# EasyEDA Pro project 达妙分电板_36mm间距_单板_V1.3.epro

# Schematic Schematic3_1
Board Name: V1.3; Create Date: 2025-01-14; Page Name: P1; Project Name: Humanoid Robot 分电板; Schematic Name: Schematic3_1; Update Date: 2025-01-14; Company: 嘉立创EDA; Page Size: A3; Version: V1.0
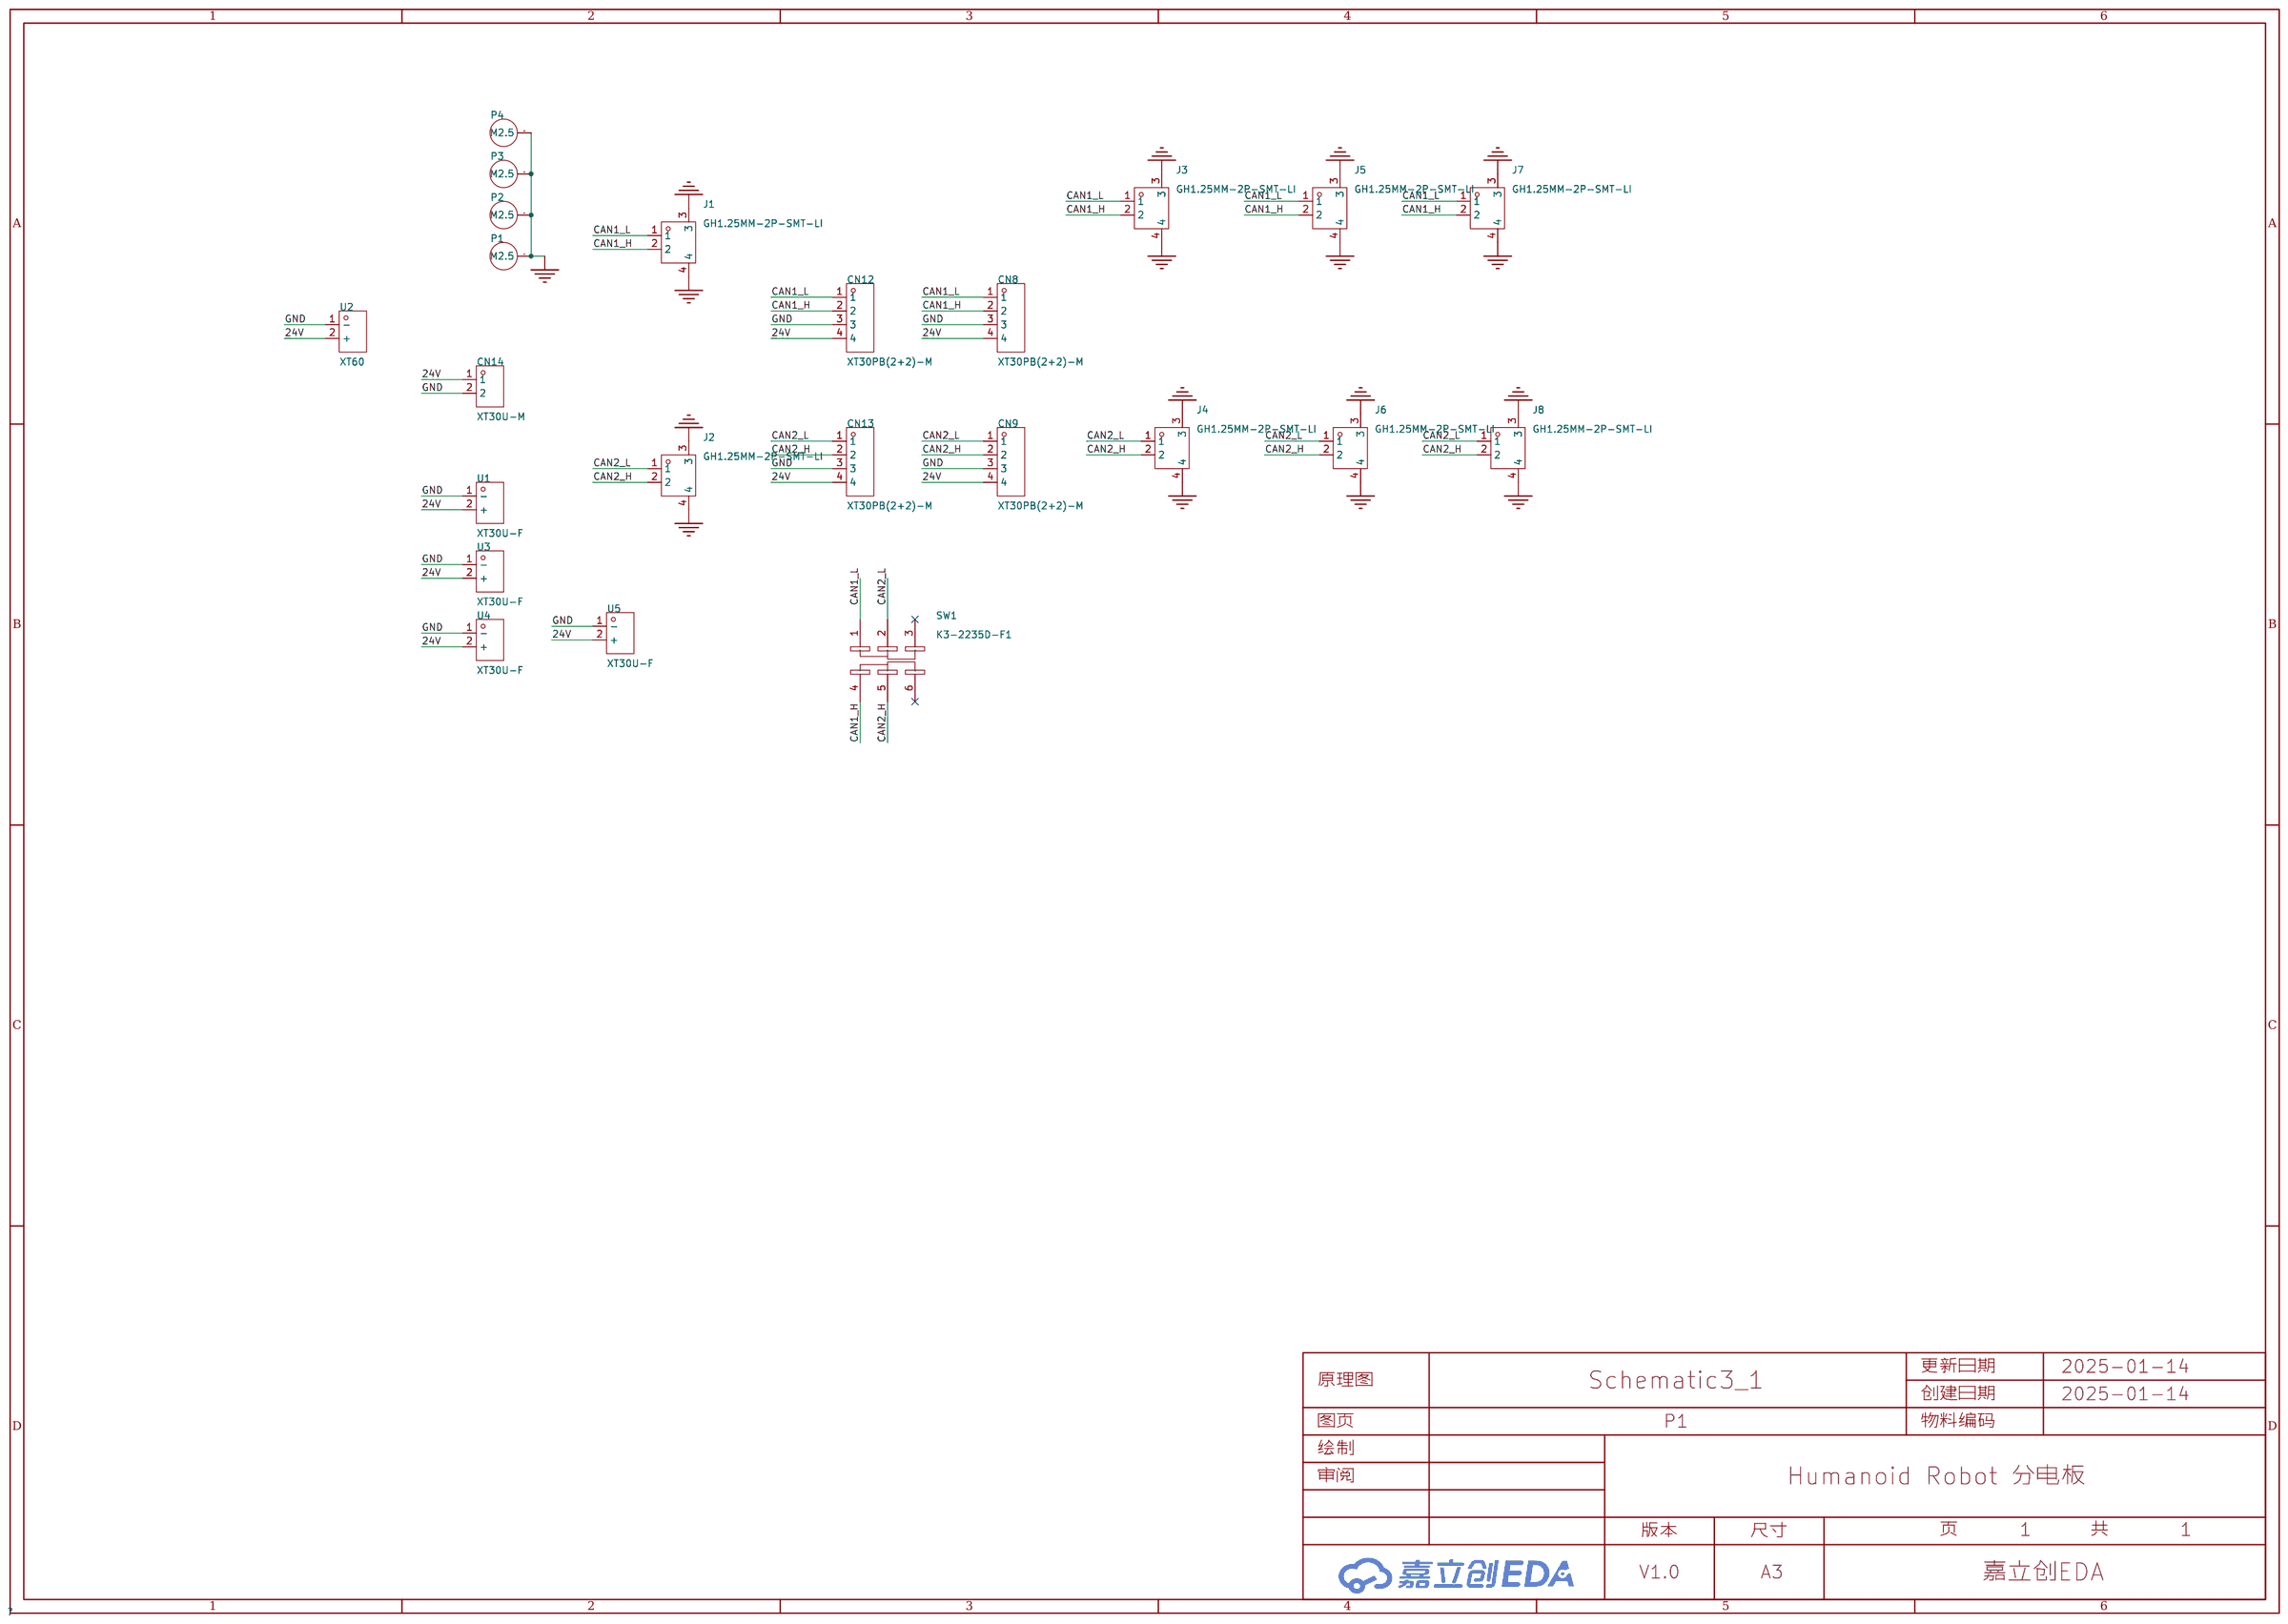
[diagram p0: schematic sheet]

## Parts
CN8  XT30PB(2+2)-M  [CONN-TH_XT30PB-M]
CN9  XT30PB(2+2)-M  [CONN-TH_XT30PB-M]
CN12  XT30PB(2+2)-M  [CONN-TH_XT30PB-M]
CN13  XT30PB(2+2)-M  [CONN-TH_XT30PB-M]
CN14  XT30U-M  [CONN-TH_XT30U-M]
J1  GH1.25MM-2P-SMT-LI  [CONN-SMD_2P-P1.25_GH1.25-2PLI]
J2  GH1.25MM-2P-SMT-LI  [CONN-SMD_2P-P1.25_GH1.25-2PLI]
J3  GH1.25MM-2P-SMT-LI  [CONN-SMD_2P-P1.25_GH1.25-2PLI]
J4  GH1.25MM-2P-SMT-LI  [CONN-SMD_2P-P1.25_GH1.25-2PLI]
J5  GH1.25MM-2P-SMT-LI  [CONN-SMD_2P-P1.25_GH1.25-2PLI]
J6  GH1.25MM-2P-SMT-LI  [CONN-SMD_2P-P1.25_GH1.25-2PLI]
J7  GH1.25MM-2P-SMT-LI  [CONN-SMD_2P-P1.25_GH1.25-2PLI]
J8  GH1.25MM-2P-SMT-LI  [CONN-SMD_2P-P1.25_GH1.25-2PLI]
P1  -  [M2.5_PAD]
P2  -  [M2.5_PAD]
P3  -  [M2.5_PAD]
P4  -  [M2.5_PAD]
SW1  K3-2235D-F1  [SW-TH_K3-2235D-F1]
U1  XT30U-F  [CONN-TH_XT30U-F]
U2  XT60  [CONN-TH_XT60]
U3  XT30U-F  [CONN-TH_XT30U-F]
U4  XT30U-F  [CONN-TH_XT30U-F]
U5  XT30U-F  [CONN-TH_XT30U-F]

## Library data of the parts
CN8 CN9 CN12 CN13 = XT30PB(2+2)-M: Supplier Part: C3040128; Manufacturer: AMASS(艾迈斯); Supplier Footprint: P=5mm; Datasheet: https://atta.szlcsc.com/upload/public/pdf/source/20220617/8874A8DD1903B9039419E118FC86C593.pdf; Supplier: LCSC
CN14 = XT30U-M: 类别:-;类型1:-;; LCSC Part Name: AMASS(艾迈斯)轻量版锂电池插头公头 XT30U-M; Supplier Part: C99101; Manufacturer: AMASS(艾迈斯); JLCPCB Part Class: 扩展库; Datasheet: https://atta.szlcsc.com/upload/public/pdf/source/20170606/1496716542582.pdf; Supplier: LCSC; Brand: 艾迈斯; Type: 插头; Colour: 黄色; InterfaceType: 公头
J1-J8 = GH1.25MM-2P-SMT-LI: Supplier Part: C9900017111; Supplier Footprint: GH1.25MM; JLCPCB Part Class: 扩展库; Supplier: LCSC
P1-P4 = M2.5焊盘固定孔
SW1 = K3-2235D-F1: 电路结构:双刀双掷;安装方式:直插;开关颜色:黑色;额定电流(DC):300mA;额定电压(DC):6V;额定电流(AC):-;额定电压(AC):-;机械寿命:1万次;; LCSC Part Name: 直插双档 滑动开关; Supplier Part: C189615; Manufacturer: 韩国韩荣; Supplier Footprint: 插件; JLCPCB Part Class: 扩展库; Datasheet: https://atta.szlcsc.com/upload/public/pdf/source/20210810/9F56F04DF7CBA8FC4D1B091DF1444945.pdf; Supplier: LCSC; Circuit: 双刀双掷; Actuator Style: 矩形柱状; Pin Style: PC引脚; Switch Length: 9mm; Switch Width: 3.5mm; Switch Height: 3.5mm; Mounting Style: 直插; Actuator Color: 黑色; Current Rating (DC): 300mA; Voltage Rating (DC): 6V; Mechanical Life: 1万次; Operating Temperature: -25℃~+80℃
U1 U3-U5 = XT30U-F: 类别:-;类型1:-;; LCSC Part Name: AMASS(艾迈斯)轻量版锂电池插头母头 XT30U-F; Supplier Part: C99102; Manufacturer: AMASS(艾迈斯); JLCPCB Part Class: 扩展库; Datasheet: https://atta.szlcsc.com/upload/public/pdf/source/20190916/C428721_B0ECB8C5937139CEFE8736D2D3175B0E.pdf; Supplier: LCSC; Brand: 艾迈斯; Type: 插头; Colour: 黄色; InterfaceType: 母头
U2 = XT60: 类别:-;类型1:-;; LCSC Part Name: AMASS(艾迈斯) XT60模型插头 3.5mm镀金香蕉头公头（电调端）XT60-M; Supplier Part: C98733; Manufacturer: AMASS(艾迈斯); JLCPCB Part Class: 扩展库; Datasheet: https://atta.szlcsc.com/upload/public/pdf/source/20170606/1496716524919.pdf; Supplier: LCSC; Brand: 艾迈斯; Type: 香蕉头; Colour: 黄色; InterfaceType: 公头; specifications: 3.5mm

## Nets
24V: CN8.4 CN9.4 CN12.4 CN13.4 CN14.1 U1.2(+) U2.2(+) U3.2(+) U4.2(+) U5.2(+)
GND: CN8.3 CN9.3 CN12.3 CN13.3 CN14.2 J1.3 J1.4 J2.3 J2.4 J3.3 J3.4 J4.3 J4.4 J5.3 J5.4 J6.3 J6.4 J7.3 J7.4 J8.3 J8.4 P1.1(M2.5) P2.1(M2.5) P3.1(M2.5) P4.1(M2.5) U1.1(-) U2.1(-) U3.1(-) U4.1(-) U5.1(-)
CAN1_H: CN8.2 CN12.2 J1.2 J3.2 J5.2 J7.2 SW1.4
CAN1_L: CN8.1 CN12.1 J1.1 J3.1 J5.1 J7.1 SW1.1
CAN2_H: CN9.2 CN13.2 J2.2 J4.2 J6.2 J8.2 SW1.5
CAN2_L: CN9.1 CN13.1 J2.1 J4.1 J6.1 J8.1 SW1.2

Not connected (* = marked no-connect by the designer): SW1 3* 6*

# Board PCB7_1
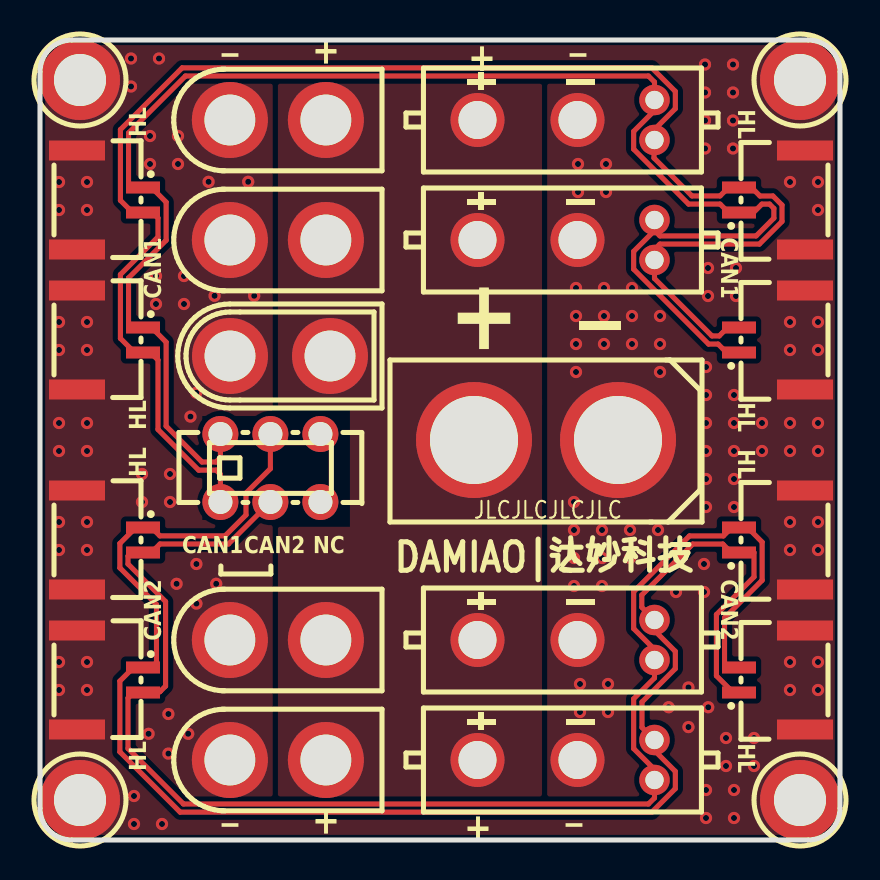
[diagram p1: board, top side]
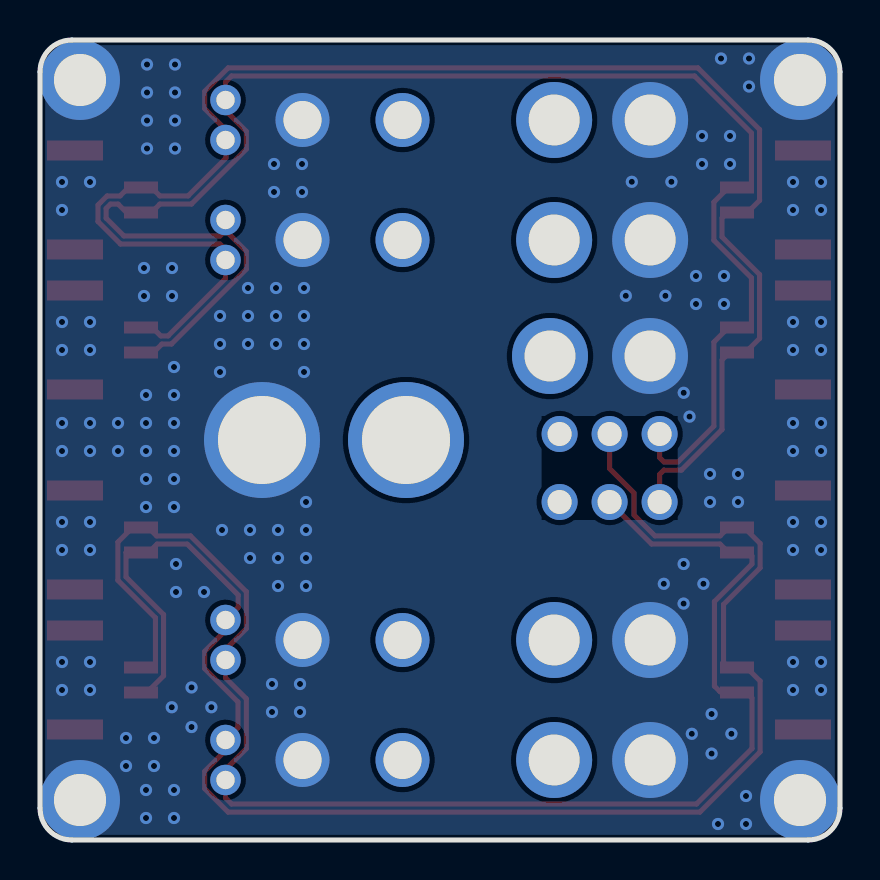
[diagram p2: board, bottom side, seen from below]

Outline 40 x 40 mm; copper layers: Top Layer, Bottom Layer. Coordinates in mm from the lower left corner of the outline.
Outline path: 0,38.4 0,1.6 arc(0.47,0.47) 1.6,0 38.4,0 arc(39.53,0.47) 40,1.6 40,38.4 arc(39.53,39.53) 38.4,40 1.6,40 arc(0.47,39.53) 0,38.4
Stack: Top Layer 0.035mm / Dielectric1 1.51mm FR4 er 4.5 / Bottom Layer 0.035mm

## Design rules (mm)
net CAN2_L: DP2
net CAN2_H: DP2
net CAN1_L: DP3
net CAN1_H: DP3
template: 自定义配置
spacing copperThickness1oz (default): track to track 0.102, other pairs 0.152 to 0.3
spacing copperThickness2oz: track to track 0.203, other pairs 0.152 to 0.3
track width copperThickness1oz (default): min 0.127, default 0.254, max 2.54
track width copperThickness2oz: min 0.203, default 0.254, max 2.54
differential pair differentialPair (default): width min 0.127, default 0.254, max 2.54; gap min 0.152, default 0.152
via viaSize (default): diameter min 0.5, default 0.61, max 10; hole min 0.3, default 0.305, max 6.3
net GND uses copperRegion1
net 24V uses copperRegion1

## Placement (name value [footprint] x y rotation side)
CN8  XT30PB(2+2)-M  [CONN-TH_XT30PB-M]  26.3 30 0 top
CN9  XT30PB(2+2)-M  [CONN-TH_XT30PB-M]  26.3 10 0 top
CN12  XT30PB(2+2)-M  [CONN-TH_XT30PB-M]  26.3 36 0 top
CN13  XT30PB(2+2)-M  [CONN-TH_XT30PB-M]  26.3 4 0 top
CN14  XT30U-M  [CONN-TH_XT30U-M]  12 24.2 180 top
J1  GH1.25MM-2P-SMT-LI  [CONN-SMD_2P-P1.25_GH1.25-2PLI]  36.6 32 90 top
J2  GH1.25MM-2P-SMT-LI  [CONN-SMD_2P-P1.25_GH1.25-2PLI]  36.6 15 90 top
J3  GH1.25MM-2P-SMT-LI  [CONN-SMD_2P-P1.25_GH1.25-2PLI]  36.6 25 90 top
J4  GH1.25MM-2P-SMT-LI  [CONN-SMD_2P-P1.25_GH1.25-2PLI]  36.6 8 90 top
J5  GH1.25MM-2P-SMT-LI  [CONN-SMD_2P-P1.25_GH1.25-2PLI]  3.5 32 270 top
J6  GH1.25MM-2P-SMT-LI  [CONN-SMD_2P-P1.25_GH1.25-2PLI]  3.5 8 270 top
J7  GH1.25MM-2P-SMT-LI  [CONN-SMD_2P-P1.25_GH1.25-2PLI]  3.5 25 270 top
J8  GH1.25MM-2P-SMT-LI  [CONN-SMD_2P-P1.25_GH1.25-2PLI]  3.5 15 270 top
P1  -  [M2.5_PAD]  38 2 0 top
P2  -  [M2.5_PAD]  38 38 0 top
P3  -  [M2.5_PAD]  2 38 0 top
P4  -  [M2.5_PAD]  2 2 0 top
SW1  K3-2235D-F1  [SW-TH_K3-2235D-F1]  11.52 18.6 0 top
U1  XT30U-F  [CONN-TH_XT30U-F]  11.89 30 180 top
U2  XT60  [CONN-TH_XT60]  25.3 20 180 top
U3  XT30U-F  [CONN-TH_XT30U-F]  11.89 36 180 top
U4  XT30U-F  [CONN-TH_XT30U-F]  11.89 4 180 top
U5  XT30U-F  [CONN-TH_XT30U-F]  11.89 10 180 top

## Footprints (pads in the part's own frame, mm; a bottom-side part is the same pattern mirrored in y, then rotated)
CONN-SMD_2P-P1.25_GH1.25-2PLI
  rect 0.6x1.7 smd: 1(-0.625,1.65) 2(0.625,1.65)
  rect 1x2.8 smd: 3(-2.475,-1.65) 4(2.475,-1.65)
CONN-TH_XT30PB-M
  round 1.524 hole 0.914: 1(4.425,1) 2(4.425,-1)
  round 2.7 hole 1.9: 3(0.575,0) 4(-4.425,0)
CONN-TH_XT30U-F
  round 3.8 hole 2.54: 1(2.4,0) 2(-2.4,0)
CONN-TH_XT30U-M
  round 3.8 hole 2.54: 1(-2.5,0) 2(2.5,0)
CONN-TH_XT60
  round 5.8 hole 4.4: 1(-3.6,0) 2(3.6,0)
M2.5_PAD
  round 4 hole 2.6: 1(0,0)
SW-TH_K3-2235D-F1
  round 1.8 hole 1.2: 1(-2.5,1.7) 2(0,1.7) 3(2.5,1.7) 4(-2.5,-1.7) 5(0,-1.7) 6(2.5,-1.7)

## Nets
As in the schematic.

Pads without a net: SW1 3 6

## Via types
v1: diameter 0.61, hole 0.305, Top Layer to Bottom Layer, 142 vias

## Routing (per net, layer and track width the routed paths; a pad name or vN(x,y) marks a point on that pad's centre or on a via; arc(x,y) is an arc through that point)
GND:
  vias: v1(0.95,32.9) v1(0.95,31.5) v1(0.95,25.9) v1(0.95,24.5) v1(0.95,20.85) v1(0.95,19.45) v1(0.95,15.9) v1(0.95,14.5) v1(0.95,8.9) v1(0.95,7.5) v1(2.35,32.9) v1(2.35,31.5) v1(2.35,25.9) v1(2.35,24.5) v1(2.35,20.85) v1(2.35,19.45) v1(2.35,15.9) v1(2.35,14.5) v1(2.35,8.9) v1(2.35,7.5) v1(4.55,39.08) v1(4.55,37.67) v1(4.7,2.2) v1(4.7,0.8) v1(5.1,18.3) v1(5.1,16.9) v1(5.43,5.31) v1(5.5,35.2) v1(5.5,33.8) v1(5.8,28.2) v1(5.8,26.8) v1(5.95,39.08) v1(6.1,0.8) v1(6.42,6.3) v1(6.42,4.32) v1(6.5,18.3) v1(6.5,16.9) v1(6.83,12.81) v1(6.9,35.2) v1(6.9,33.8) v1(7.2,28.2) v1(7.2,26.8) v1(7.41,5.31) v1(7.52,21.17) v1(7.81,22.36) v1(7.82,13.8) v1(7.82,11.82) v1(8.43,32.91) v1(8.73,27.21) v1(8.81,12.81) v1(10.41,32.91) v1(10.71,27.21) v1(26.7,16.9) v1(26.7,15.5) v1(26.7,14.1) v1(26.7,12.7) v1(26.8,27.6) v1(26.8,26.2) v1(26.8,24.8) v1(26.8,23.4) v1(26.9,33.8) v1(26.9,32.4) v1(27,7.8) v1(27,6.4) v1(28.1,15.5) v1(28.1,14.1) v1(28.1,12.7) v1(28.2,27.6) v1(28.2,26.2) v1(28.2,24.8) v1(28.3,33.8) v1(28.3,32.4) v1(28.4,7.8) v1(28.4,6.4) v1(29.5,15.5) v1(29.5,14.1) v1(29.6,27.6) v1(29.6,26.2) v1(29.6,24.8) v1(30.9,15.5) v1(31,26.2) v1(31,24.8) v1(31,23.4) v1(31.43,6.64) v1(31.8,12.4) v1(32.42,7.63) v1(32.42,5.65) v1(33.25,38.78) v1(33.25,37.38) v1(33.25,35.98) v1(33.25,34.58) v1(33.2,13.8) v1(33.2,12.4) v1(33.3,23.65) v1(33.3,22.25) v1(33.3,20.85) v1(33.3,19.45) v1(33.3,18.05) v1(33.3,16.65) v1(33.3,2.5) v1(33.3,1.1) v1(33.4,28.6) v1(33.4,27.2) v1(33.41,6.64) v1(34.3,5.1) v1(34.3,3.7) v1(34.65,38.78) v1(34.65,37.38) v1(34.65,35.98) v1(34.65,34.58) v1(34.7,22.25) v1(34.7,20.85) v1(34.7,19.45) v1(34.7,18.05) v1(34.7,16.65) v1(34.7,2.5) v1(34.7,1.1) v1(34.8,28.6) v1(34.8,27.2) v1(35.7,5.1) v1(35.7,3.7) v1(36.1,20.85) v1(36.1,19.45) v1(37.5,32.9) v1(37.5,25.9) v1(37.5,24.5) v1(37.5,20.85) v1(37.5,19.45) v1(37.5,15.9) v1(37.5,14.5) v1(37.5,8.9) v1(37.5,7.5) v1(38.9,32.9) v1(38.9,31.5) v1(38.9,25.9) v1(38.9,24.5) v1(38.9,20.85) v1(38.9,19.45) v1(38.9,15.9) v1(38.9,14.5) v1(38.9,8.9) v1(38.9,7.5)
CAN1_H: length 79.6
  Top Layer w0.254: J3.2 34.38,25.62 33.96,25.2 33.6,25.2 30.72,28.08 CN8.2 30.72,29.53 31,29.8 35.97,29.8 37.1,30.93 37.1,31.75 36.65,32.2 36,32.2 35.57,32.62 J1.2 34.42,32.62 34,32.2 32.6,32.2 30.7,34.1 30.7,34.98 CN12.2 30.72,35.53 31.77,36.57 31.77,37.43 30.59,38.61 7.11,38.61 4.02,35.52 4.02,31.98 4.62,31.37 J5.2 5.62,31.37 5.9,31.1 5.9,30.15 4.02,28.27 4.02,25.08 4.72,24.37 J7.2 5.53,24.37 5.9,24 5.9,20.53 7.93,18.49 8.81,18.49 9.02,18.28 SW1.4
CAN1_L: length 79.7
  Top Layer w0.254: 30.72,30.48 30.72,30.47 29.68,29.43 29.68,28.54 33.43,24.8 33.9,24.8 34.32,24.38 J3.1 ; 30.72,30.48 CN8.1 ; 30.72,30.48 31,30.2 35.8,30.2 36.69,31.09 36.69,31.58 36.48,31.8 36.09,31.8 35.67,31.38 J1.1 34.42,31.38 34,31.8 32.43,31.8 29.68,34.54 29.68,35.43 30.72,36.47 CN12.1 30.72,37.9 30.42,38.2 7.27,38.2 4.43,35.35 4.43,32.77 4.57,32.62 5.57,32.62 6.31,31.89 6.31,29.99 4.43,28.11 4.43,25.77 4.57,25.62 5.57,25.62 6.31,24.89 6.31,20.69 8.1,18.9 8.8,18.9 9.02,19.12 SW1.1
CAN2_H: length 74.9
  Top Layer w0.254: J4.2 34.23,8.62 34.23,11.11 36.11,12.99 36.11,14.89 35.38,15.62 J2.2 34.59,15.62 34.17,15.2 32.47,15.2 29.68,12.42 29.68,10.57 30.72,9.53 CN9.2 30.72,8.1 29.68,7.06 29.68,4.57 30.72,3.53 CN13.2 30.72,2.1 30.42,1.8 7.17,1.8 4.4,4.57 4.4,7.1 4.67,7.37 J6.2 ; SW1.5 9.42,14.8 6,14.8 5.57,14.37 J8.2 4.58,14.37 4.4,14.2 4.4,13.8 6.28,11.92 6.28,7.7 6,7.41 5.39,7.41
CAN2_L: length 80.8
  Top Layer w0.254: J4.1 34.66,7.38 33.82,8.21 33.82,11.27 35.7,13.15 35.7,14.38 J2.1 34.56,14.38 34.14,14.8 32.64,14.8 30.09,12.25 30.09,11.64 CN9.1 30.72,10.47 31.77,9.43 31.77,8.57 30.1,6.9 30.1,5.62 CN13.1 30.72,4.47 31.77,3.43 31.77,2.57 30.59,1.39 7.01,1.39 3.99,4.41 3.99,7.95 4.67,8.62 5.57,8.62 5.82,8.88 5.82,11.78 3.99,13.61 3.99,14.83 4.79,15.62 5.57,15.62 5.99,15.21 9.25,15.21 10.3,16.25 10.3,17.35 11.52,18.57 SW1.2

## Copper pours and planes (outline as drawn; the poured copper is in the pictures)
24V on Top Layer: 11.89,38.03 25.1,38.03 25.1,21.62 11.89,21.62
24V on Top Layer: 15.49,22.15 25.1,22.15 25.1,12.59 15.49,12.59
24V on Top Layer: 11.89,15.66 25.1,15.66 25.1,2.1 11.89,2.1
GND on Top Layer: -1.7,42 41.4,42 41.4,-1.3 -1.7,-1.3
GND on Bottom Layer: -1.5,42 41.6,42 41.6,-1.3 -1.5,-1.3

## Text on the board
Top Silkscreen Layer: JLCJLCJLCJLC | CAN1 | CAN2 | NC | HL | + | _ | DAMIAO|达妙科技
